# Altium schematic sheet ALIM_MOSFET.SchDoc
size A4; SheetNumber: 5; SheetTotal: 7
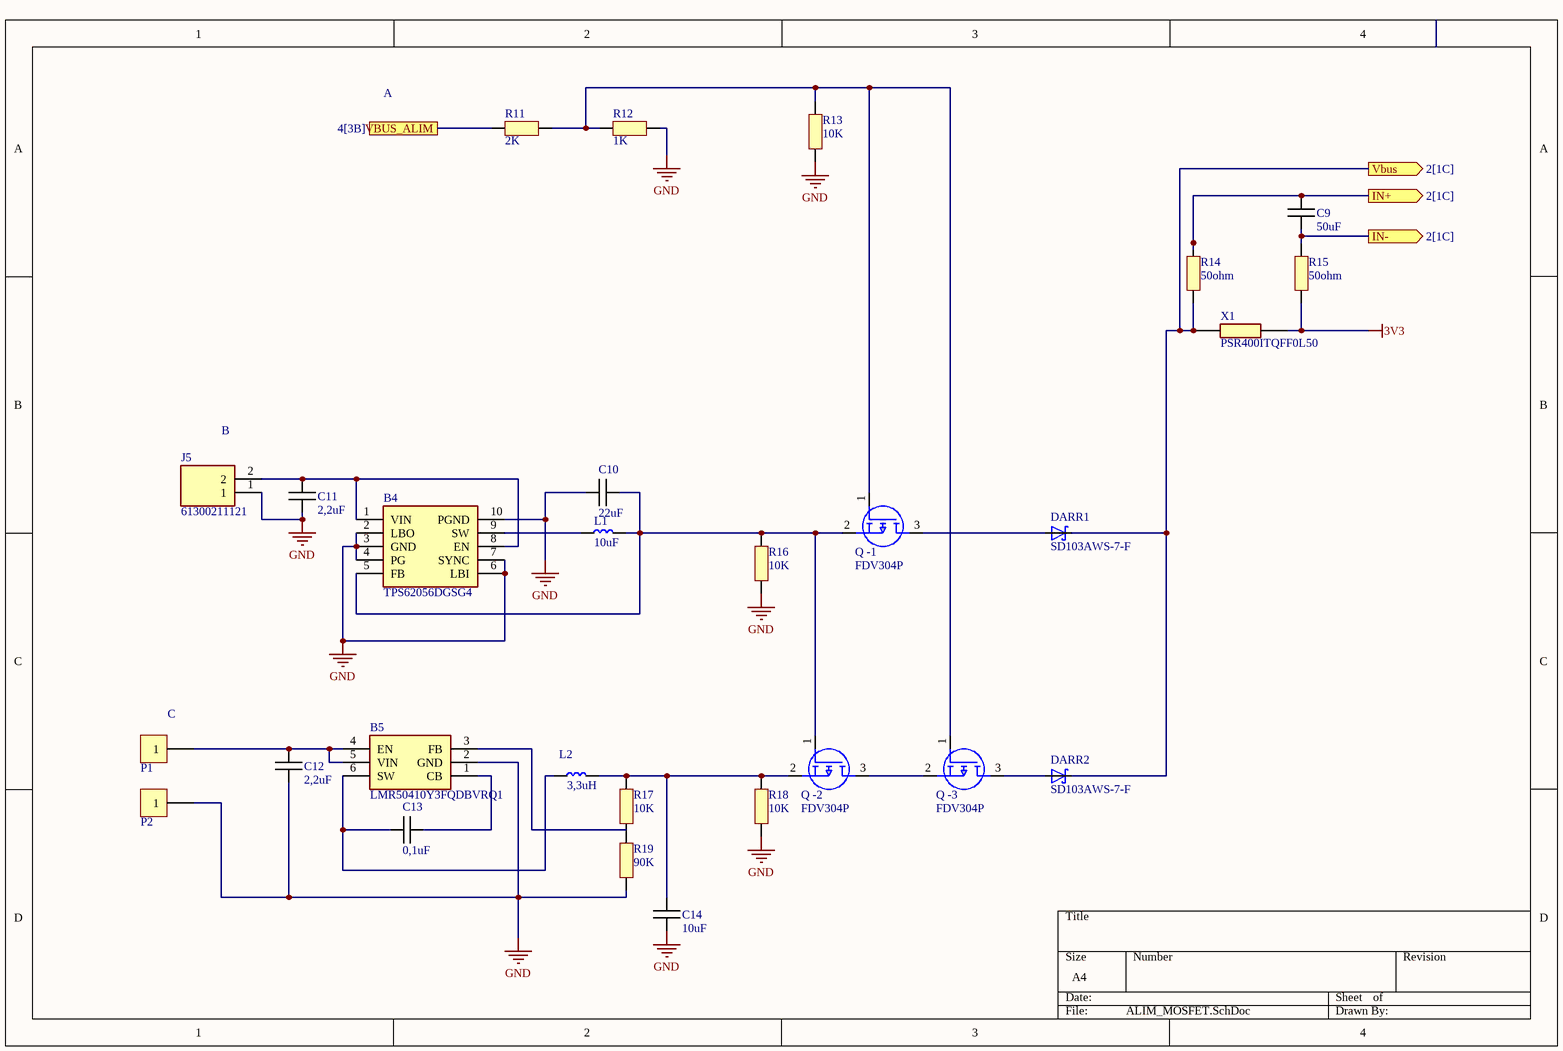
[diagram p0: ALIM_MOSFET.SchDoc]

## Parts
B4  TPS62056DGSG4  [SOP50P490X110-10N]
B5  LMR50410Y3FQDBVRQ1  [SOT95P280X145-6N]
C9  50uF  [CAPC1005X06N]
C10  22uF  [CAPC1005X06N]
C11  2,2uF  [CAPC1005X06N]
C12  2,2uF  [CAPC1005X06N]
C13  0,1uF  [CAPC1005X06N]
C14  10uF  [CAPC1005X06N]
DARR1  SD103AWS-7-F  [SD103AWS-7-F]
DARR2  SD103AWS-7-F  [SD103AWS-7-F]
J5  61300211121  [61300211121]
L1  10uF  [LQPC1005X06N]
L2  3,3uH  [LQPC1005X06N]
P1  Plage CMS 10x5  [Plage CMS 10x5]  (value not drawn)  (no BOM)
P2  Plage CMS 10x5  [Plage CMS 10x5]  (value not drawn)  (no BOM)
Q_-1  FDV304P  [SOT95P251X112-3N]
Q_-2  FDV304P  [SOT95P251X112-3N]
Q_-3  FDV304P  [SOT95P251X112-3N]
R11  2K  [RESC1005X06N]
R12  1K  [RESC1005X06N]
R13  10K  [RESC1005X06N]
R14  50ohm  [RESC1005X06N]
R15  50ohm  [RESC1005X06N]
R16  10K  [RESC1005X06N]
R17  10K  [RESC1005X06N]
R18  10K  [RESC1005X06N]
R19  90K  [RESC1005X06N]
X1  PSR400ITQFF0L50  [RESC10052X200N]

## Ports
IN+ (out, see 2[1C]), IN- (out, see 2[1C]), Vbus (out, see 2[1C]), VBUS_ALIM (see 4[3B])

## Nets
3V3: R15.1 X1.2
GND: B4.2(LBO) B4.3(GND) B4.4(PG) B4.6(LBI) B4.7(SYNC) B4.10(PGND) B5.2(GND) C10.2 C11.2 C12.2 C14.2 J5.1 P2.1 R12.2 R13.2 R16.2 R18.2 R19.2
IN+: C9.1 R14.2 ; port IN+
IN-: C9.2 R15.2 ; port IN-
Vbus: DARR1.1(C) DARR2.1(C) R14.1 X1.1 ; port Vbus
VBUS_ALIM: R11.1 ; port VBUS_ALIM
NetB4_1: B4.1(VIN) B4.8(EN) C11.1 J5.2
NetB4_5: B4.5(FB) C10.1 L1.2 Q_-1.2(S) Q_-2.1(G) R16.1
NetB4_9: B4.9(SW) L1.1
NetB5_1: B5.1(CB) C13.1
NetB5_3: B5.3(FB) R19.1
NetB5_4: B5.4(EN) B5.5(VIN) C12.1 P1.1
NetB5_6: B5.6(SW) C13.2 L2.1
NetC14_1: C14.1 L2.2 Q_-2.2(S) R17.1 R18.1
NetDARR1_2: DARR1.2(A) Q_-1.3(D)
NetDARR2_2: DARR2.2(A) Q_-3.3(D)
NetQ_-1_1: Q_-1.1(G) Q_-3.1(G) R11.2 R12.1 R13.1
NetQ_-2_3: Q_-2.3(D) Q_-3.2(S)

Not connected (* = marked no-connect by the designer): R17 2

## Notes on the sheet
- A
- (near J5) B
- (near P1) C

## Library data of the parts
B4 = TPS62056DGSG4: TEXAS INSTRUMENTS - TPS62056DGSG4 - Synchronous Buck (Step Down) Switching Regulator, Fixed, 2.7V-10Vin, 3.3V/0.8A out, 850kHz, VSSOP-10; Manufacturer_Name: Texas Instruments; Manufacturer_Part_Number: TPS62056DGSG4; Mouser Part Number: 595-TPS62056DGSG4
B5 = LMR50410Y3FQDBVRQ1: Régulateurs de tension de commutation Automotive qualified SIMPLE SWITCHER 4-V to 36-V, 1-A synchronous step-down converter 6-SOT-23 -40 to 150; Manufacturer_Name: Texas Instruments; Manufacturer_Part_Number: LMR50410Y3FQDBVRQ1; Mouser Part Number: 595-R50410Y3FQDBVRQ1
C9-C14 = Capacitor
DARR1 DARR2 = SD103AWS-7-F: Diode Array 3 Independent Schottky 40V 175mA Surface Mount 6-TSSOP, SC-88, SOT-363
J5 = 61300211121: WURTH ELEKTRONIK - 61300211121 - HEADER, 2.54MM, PIN, THT, VERTICAL, 2WAY
L1 L2 = Bobine
P1 P2 = Plage CMS 10x5: Plage de report CMS 10x5mm; PN: L30; Value: Plage CMS 10x5; Footprint_statut: ok
Q_-1-Q_-3 = FDV304P: ON SEMICONDUCTOR - FDV304P - Power MOSFET, P Channel, 25 V, 460 mA, 1.22 ohm, SOT-23, Surface Mount; Manufacturer_Name: onsemi; Geometry.Height: 1.12mm; Manufacturer_Part_Number: FDV304P; Mouser Part Number: 512-FDV304P; Mouser Price/Stock: https://www.mouser.co.uk/ProductDetail/onsemi-Fairchild/FDV304P?qs=FOlmdCx%252BAA1BAlCQZu888w%3D%3D; Arrow Part Number: FDV304P; Arrow Price/Stock: https://www.arrow.com/en/products/fdv304p/on-semiconductor?utm_currency=USD&region=europe; Datasheet Link: https://componentsearchengine.com/Datasheets/2/FDV304P.pdf
R11-R19 = Resistor
X1 = PSR400ITQFF0L50: ROHM - PSR400ITQFF0L50 - SMD Current Sense Resistor, 500 ohm, PSR Series, 3921 [1052 Metric], 4 W, +/- 1%, Metal Strip; Manufacturer_Name: ROHM Semiconductor; Geometry.Height: 2mm; Manufacturer_Part_Number: PSR400ITQFF0L50; Mouser Part Number: 755-PSR400ITQFF0L50; Mouser Price/Stock: https://www.mouser.co.uk/ProductDetail/ROHM-Semiconductor/PSR400ITQFF0L50?qs=493kPxzlxfLaT1w5Mo%252BtHg%3D%3D; Arrow Part Number: *; Arrow Price/Stock: *; Datasheet Link: https://componentsearchengine.com/Datasheets/2/PSR400ITQFF0L50.pdf